# EAGLE design Teseo (EAGLE 9.0.0)
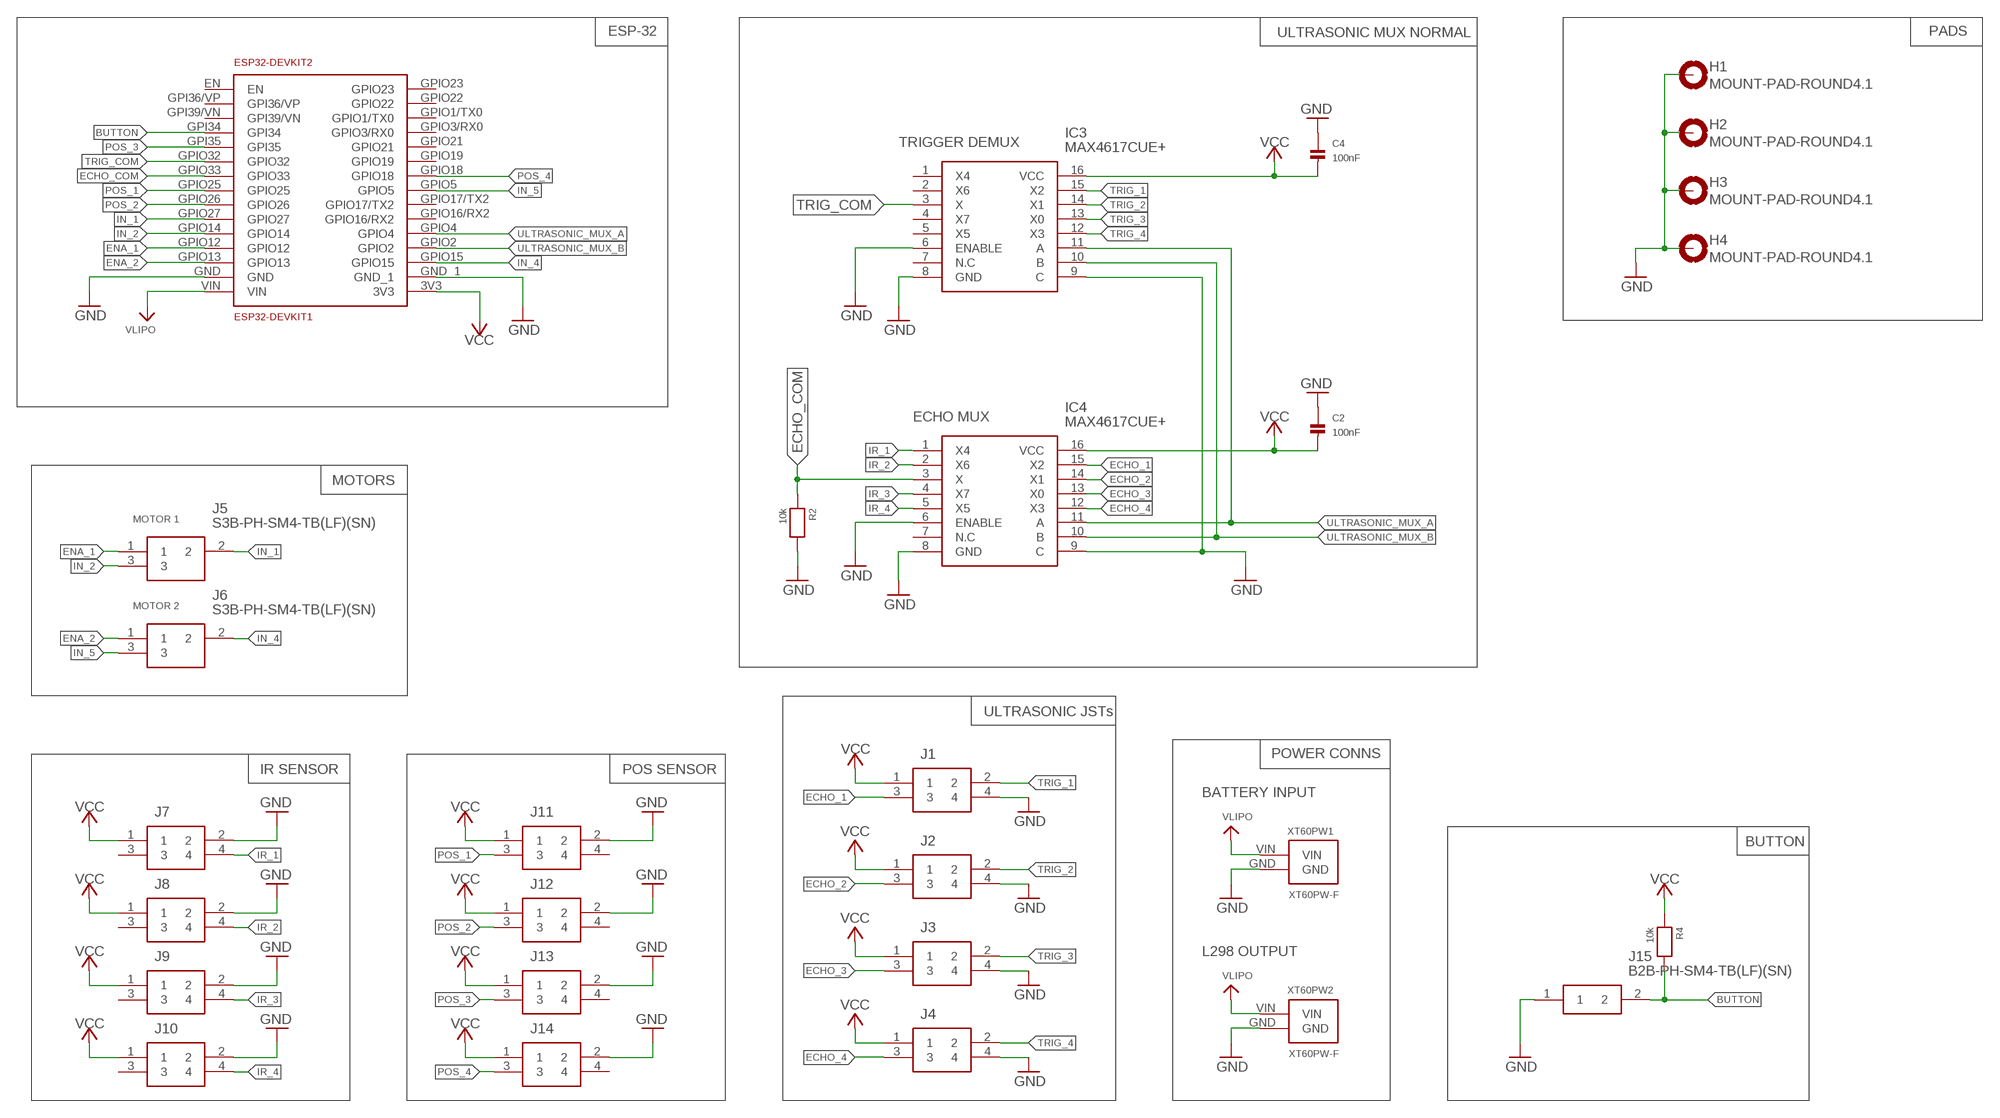
[diagram p0: schematic, sheet 1]

## Parts
C2  100nF  CAP_CERAMIC0805  [0805]
C4  100nF  CAP_CERAMIC0805  [0805]
ESP32-DEVKIT2  ESP32-DEVKIT1  [ESP32-DEVKIT1]
H1  MOUNT-PAD-ROUND4.1  [4,1-PAD]
H2  MOUNT-PAD-ROUND4.1  [4,1-PAD]
H3  MOUNT-PAD-ROUND4.1  [4,1-PAD]
H4  MOUNT-PAD-ROUND4.1  [4,1-PAD]
IC3  MAX4617CUE+  [SOP65P640X110-16N]
IC4  MAX4617CUE+  [SOP65P640X110-16N]
J1  S4B-PH-SM4-TB(LF)(SN)  [S4B-PH-SM4-TB]
J2  S4B-PH-SM4-TB(LF)(SN)  [S4B-PH-SM4-TB]
J3  S4B-PH-SM4-TB(LF)(SN)  [S4B-PH-SM4-TB]
J4  S4B-PH-SM4-TB(LF)(SN)  [S4B-PH-SM4-TB]
J5  S3B-PH-SM4-TB(LF)(SN)  [S3B-PH-SM4-TB]
J6  S3B-PH-SM4-TB(LF)(SN)  [S3B-PH-SM4-TB]
J7  S4B-PH-SM4-TB(LF)(SN)  [S4B-PH-SM4-TB]
J8  S4B-PH-SM4-TB(LF)(SN)  [S4B-PH-SM4-TB]
J9  S4B-PH-SM4-TB(LF)(SN)  [S4B-PH-SM4-TB]
J10  S4B-PH-SM4-TB(LF)(SN)  [S4B-PH-SM4-TB]
J11  S4B-PH-SM4-TB(LF)(SN)  [S4B-PH-SM4-TB]
J12  S4B-PH-SM4-TB(LF)(SN)  [S4B-PH-SM4-TB]
J13  S4B-PH-SM4-TB(LF)(SN)  [S4B-PH-SM4-TB]
J14  S4B-PH-SM4-TB(LF)(SN)  [S4B-PH-SM4-TB]
J15  B2B-PH-SM4-TB(LF)(SN)  [B2B-PH-SM4-TB]
R2  10k  RESISTOR_0805  [_0805]
R4  10k  RESISTOR_0805  [_0805]
XT60PW1  XT60PW-F  [XT60PW-F]
XT60PW2  XT60PW-F  [XT60PW-F]

## Nets
BUTTON: ESP32-DEVKIT2.GPI34 J15.2 R4.2
ECHO_1: IC4.15(X2) J1.3
ECHO_2: IC4.14(X1) J2.3
ECHO_3: IC4.13(X0) J3.3
ECHO_4: IC4.12(X3) J4.3
ECHO_COM: ESP32-DEVKIT2.GPIO33 IC4.3(X) R2.1
ENA_1: ESP32-DEVKIT2.GPIO12 J5.1
ENA_2: ESP32-DEVKIT2.GPIO13 J6.1
GND: C2.1 C4.1 ESP32-DEVKIT2.GND ESP32-DEVKIT2.GND_1 H1.B4,1(MOUNT) H2.B4,1(MOUNT) H3.B4,1(MOUNT) H4.B4,1(MOUNT) IC3.6(ENABLE) IC3.8(GND) IC3.9(C) IC4.6(ENABLE) IC4.8(GND) IC4.9(C) J1.4 J2.4 J3.4 J4.4 J7.2 J8.2 J9.2 J10.2 J11.2 J12.2 J13.2 J14.2 J15.1 R2.2 XT60PW1.GND XT60PW2.GND
IN_1: ESP32-DEVKIT2.GPIO27 J5.2
IN_2: ESP32-DEVKIT2.GPIO14 J5.3
IN_4: ESP32-DEVKIT2.GPIO15 J6.2
IN_5: ESP32-DEVKIT2.GPIO5 J6.3
IR_1: IC4.1(X4) J7.4
IR_2: IC4.2(X6) J8.4
IR_3: IC4.4(X7) J9.4
IR_4: IC4.5(X5) J10.4
POS_1: ESP32-DEVKIT2.GPIO25 J11.3
POS_2: ESP32-DEVKIT2.GPIO26 J12.3
POS_3: ESP32-DEVKIT2.GPI35 J13.3
POS_4: ESP32-DEVKIT2.GPIO18 J14.3
TRIG_1: IC3.15(X2) J1.2
TRIG_2: IC3.14(X1) J2.2
TRIG_3: IC3.13(X0) J3.2
TRIG_4: IC3.12(X3) J4.2
TRIG_COM: ESP32-DEVKIT2.GPIO32 IC3.3(X)
ULTRASONIC_MUX_A: ESP32-DEVKIT2.GPIO4 IC3.11(A) IC4.11(A)
ULTRASONIC_MUX_B: ESP32-DEVKIT2.GPIO2 IC3.10(B) IC4.10(B)
VCC: C2.2 C4.2 ESP32-DEVKIT2.3V3 IC3.16(VCC) IC4.16(VCC) J1.1 J2.1 J3.1 J4.1 J7.1 J8.1 J9.1 J10.1 J11.1 J12.1 J13.1 J14.1 R4.1
VLIPO: ESP32-DEVKIT2.VIN XT60PW1.VIN XT60PW2.VIN
Unconnected: ESP32-DEVKIT2.EN ESP32-DEVKIT2.GPI36/VP ESP32-DEVKIT2.GPI39/VN ESP32-DEVKIT2.GPIO1/TX0 ESP32-DEVKIT2.GPIO3/RX0 ESP32-DEVKIT2.GPIO16/RX2 ESP32-DEVKIT2.GPIO17/TX2 ESP32-DEVKIT2.GPIO19 ESP32-DEVKIT2.GPIO21 ESP32-DEVKIT2.GPIO22 ESP32-DEVKIT2.GPIO23 IC3.1(X4) IC3.2(X6) IC3.4(X7) IC3.5(X5) IC3.7(N.C) IC4.7(N.C) J7.3 J8.3 J9.3 J10.3 J11.4 J12.4 J13.4 J14.4

## Notes on the sheet
- ESP-32 | ULTRASONIC MUX NORMAL | PADS
- TRIGGER DEMUX
- ECHO MUX
- MOTORS
- MOTOR 1
- MOTOR 2
- ULTRASONIC JSTs
- POWER CONNS
- IR SENSOR | POS SENSOR
- BATTERY INPUT
- BUTTON
- L298 OUTPUT

## Library data of the parts
C2 C4 = microbuilder:CAP_CERAMIC: Ceramic Capacitors 0402 - 0402 Surface Mount Capacitors 16pF 50V 5% [Digikey: 445-4899-2-ND] 18pF 50V 5% [Digikey: 490-1281-2-ND] 22pF 50V 5% [Digikey: 490-1283-2-ND] 68pF 50V 5% [Digikey: 490-1289-2-ND] 0.1uF 10V 10% [Digikey: 490-1318-2-ND] 1.0uF 6.3V 10% [Digikey: 490-1320-2-ND] 0603 - 0603 Surface Mount Capacitors 16 pF 50V 5% [Digikey: 445-5051-2-ND] 22 pF 50V [Digikey: PCC220ACVTR-ND] 33 pF 50V 5% [Digikey: 490-1415-1-ND] 56pF 50V 5% [Digikey: 490-1421-1-ND] 220pF 50V 5% [Digikey: 445-1285-1-ND] 680 pF 50V 2200 pF 50V 5% C0G [Digikey: 445-1297-1-ND] 5600 pF 100V 5% X7R [Digikey: 478-3711-1-ND] 0.1 µF 25V 10% [Digikey: PCC2277TR-ND] 0.22 µF 16V 10% X7R [Digikey: 445-1318-1-ND] 1.0 µF 25V 10% [Digikey: 445-5146-2-ND] 0603 - RF Specific 3pF 250V +/-0.1pF RF [Digikey: 712-1347-1-ND] 18 pF 250V 5% [Digikey: 478-3505-1-ND or 712-1322-1-ND] 56 pF 250V 5% C0G RF [Digikey: 490-4867-1-ND] 68 pF 250V RF [Digikey: 490-4868-1-ND] 0805 - 0805 Surface Mount Capacitors 220 pF 250V 2% RF Ceramic Capacitor [Digikey: 712-1398-1-ND] 1000 pF 50V 2% NP0 Ceramic Capacitor [Digikey: 478-3760-1-ND] 0.1 µF 25V 10% Ceramic Capacitor [Digikey: PCC1828TR-ND] 1.0 µF 16V 10% Ceramic Capacitor[Digikey: 490-1691-2-ND] 10.0 µF 10V 10% Ceramic Capacitor[Digikey: 709-1228-1-ND] 10.0 uF 16V 10% Ceramic Capacitor [Digikey: 478-5165-2-ND] 47 uF 6.3V 20% Ceramic Capacitor [Digikey: 587-1779-1-ND or 399-5506-1-ND] 1206 - 1206 Surface Mount Capacitors 47uF 10V 20% Ceramic Capacitor [Digikey: 490-5528-1-ND or 399-5508-1-ND or 445-6010-1-ND] 100uF 6.3V -20%, +80% Y5V Ceramic Capacitor (Digikey: 490-4512-1-ND, Mouser: 81-GRM31CF50J107ZE1L)
ESP32-DEVKIT2 = mylibrary:ESP32-DEVKIT1
H1-H4 = holes:MOUNT-PAD-ROUND: MOUNTING PAD, round
IC3 IC4 = SamacSys_Parts:MAX4617CUE+: MAXIM INTEGRATED PRODUCTS - MAX4617CUE+ - MULTIPLEXER, 8X1, 10OHM RON, 16TSSOP Source: Datasheet <https://datasheets.maximintegrated.com/en/ds/MAX4617-MAX4619.pdf>; DESCRIPTION: MAXIM INTEGRATED PRODUCTS - MAX4617CUE+ - MULTIPLEXER, 8X1, 10OHM RON, 16TSSOP; HEIGHT: 1.1mm; MANUFACTURER_NAME: Maxim Integrated; MANUFACTURER_PART_NUMBER: MAX4617CUE+; MOUSER_PART_NUMBER: 700-MAX4617CUE; MOUSER_PRICE-STOCK: https://www.mouser.com/Search/Refine.aspx?Keyword=700-MAX4617CUE
J1-J4 J7-J14 = SamacSys_Parts:S4B-PH-SM4-TB(LF)(SN): PH SMT side entry shroud header 4 way JST PH Series, 2mm Pitch 4 Way 1 Row Right Angle PCB Header, Solder Termination, 2A Source: Datasheet <http://uk.rs-online.com/web/p/products/6881366>; ARROW_PART_NUMBER: S4B-PH-SM4-TB(LF)(SN); ARROW_PRICE/STOCK: https://www.arrow.com/en/products/s4b-ph-sm4-tb-lf-sn/jst-manufacturing; DESCRIPTION: PH SMT side entry shroud header 4 way JST PH Series, 2mm Pitch 4 Way 1 Row Right Angle PCB Header, Solder Termination, 2A; HEIGHT: mm; MANUFACTURER_NAME: JST (JAPAN SOLDERLESS TERMINALS); MANUFACTURER_PART_NUMBER: S4B-PH-SM4-TB(LF)(SN); RS_PART_NUMBER: 6881366P; RS_PRICE/STOCK: http://uk.rs-online.com/web/p/products/6881366P
J5 J6 = SamacSys_Parts:S3B-PH-SM4-TB(LF)(SN): PH SMT side entry shroud header 3 way JST PH Series, 2mm Pitch 3 Way 1 Row Right Angle PCB Header, Solder Termination, 2A Source: Datasheet <http://docs-emea.rs-online.com/webdocs/13ce/0900766b813ce4c2.pdf>; DESCRIPTION: PH SMT side entry shroud header 3 way JST PH Series, 2mm Pitch 3 Way 1 Row Right Angle PCB Header, Solder Termination, 2A; HEIGHT: mm; MANUFACTURER_NAME: JST (JAPAN SOLDERLESS TERMINALS); MANUFACTURER_PART_NUMBER: S3B-PH-SM4-TB(LF)(SN); RS_PART_NUMBER: 6881357P; RS_PRICE-STOCK: http://uk.rs-online.com/web/p/products/6881357P
J15 = SamacSys_Parts:B2B-PH-SM4-TB(LF)(SN): Wire-To-Board Connector, PH Series, 2 Contacts, Header, 2 mm, Surface Mount, 1 Rows Source: Datasheet <http://www.jst-mfg.com/product/pdf/eng/ePH.pdf>; DESCRIPTION: Wire-To-Board Connector, PH Series, 2 Contacts, Header, 2 mm, Surface Mount, 1 Rows; HEIGHT: mm; MANUFACTURER_NAME: JST (JAPAN SOLDERLESS TERMINALS); MANUFACTURER_PART_NUMBER: B2B-PH-SM4-TB(LF)(SN); RS_PART_NUMBER: 6881325P; RS_PRICE-STOCK: http://uk.rs-online.com/web/p/products/6881325P
R2 R4 = microbuilder:RESISTOR: Resistors 0402 - 0402 Surface Mount Package 22 Ohm 1% 1/16W [Digikey: 311-22.0LRTR-ND] 33 Ohm 5% 1/16W 1.0K 5% 1/16W 1.5K 5% 1/16W 2.0K 1% 1/16W 10.0K 1% 1/16W [Digikey: 311-10.0KLRTR-ND] 10.0K 5% 1/16W [Digikey: RMCF0402JT10K0TR-ND] 12.1K 1% 1/16W [Digikey: 311-22.0LRTR-ND] 100.0K 5% 1/16W 0603 - 0603 Surface Mount Package 0 Ohm 1/10 Watt 1% Resistor 15 Ohm 1/10 Watt 1% Resistor 33 Ohm 1/10 Watt 1% Resistor 49.9 Ohm 1/10 Watt 1% Resistor 100 Ohm 1/10 Watt 1% Resistor 150 Ohm 1/10 Watt 1% Resistor 240 Ohm 1/10 Watt 1% Resistor 390 Ohm 1/10 Watt 1% Resistor 560 Ohm 1/10 Watt 1% Resistor 680 Ohm 1/10 Watt 1% Resistor 750 Ohm 1/10 Watt 1% Resistor 1.0K Ohm 1/10 Watt 1% Resistor 1.5K Ohm 1/10 Watt 1% Resistor 2.0K Ohm 1/10 Watt 1% Resistor 2.2K Ohm 1/10 Watt 1% Resistor 3.3K Ohm 1/10 Watt 1% Resistor 4.7K Ohm 1/10 Watt 1% Resistor 10.0K Ohm 1/10 Watt 1% Resistor 12.0K Ohm 1/10 Watt 1% Resistor 12.1K Ohm 1/10 Watt 1% Resistor 20.0K Ohm 1/10 Watt 1% Resistor 33.0K Ohm 1/10 Watt 1% Resistor 100.0K Ohm 1/10 Watt 1% Resistor 0805 - 0805 Surface Mount Package 0 Ohm 1/8 Watt 1% Resistor 33 Ohm 1/8 Watt 1% Resistor 100 Ohm 1/8 Watt 1% Resistor 150 Ohm 1/8 Watt 1% Resistor 200 Ohm 1/8 Watt 1% Resistor 240 Ohm 1/8 Watt 1% Resistor 330 Ohm 1/8 Watt 1% Resistor 390 Ohm 1/8 Watt 1% Resistor 470 Ohm 1/8 Watt 1% Resistor 1.0K Ohm 1/8 Watt 1% Resistor 1.5K Ohm 1/8 Watt 1% Resistor 2.0K Ohm 1/8 Watt 1% Resistor 4.7K Ohm 1/8 Watt 1% Resistor 5.1K Ohm 1/8 Watt 1% Resistor 5.6K Ohm 1/8 Watt 1% Resistor 10.0K Ohm 1/8 Watt 1% Resistor 22.0K Ohm 1/8 Watt 1% Resistor 33.0K Ohm 1/8 Watt 1% Resistor 100K Ohm 1/8 Watt 1% Resistor 1206 - 1206 Surface Mount Package 2012 - 2010 Surface Mount Package 0.11 Ohm 1/2 Watt 1% Resistor - Digikey: RHM.11UCT-ND
XT60PW1 XT60PW2 = mylibrary:XT60PW-F; SPICEPREFIX: X

## Board
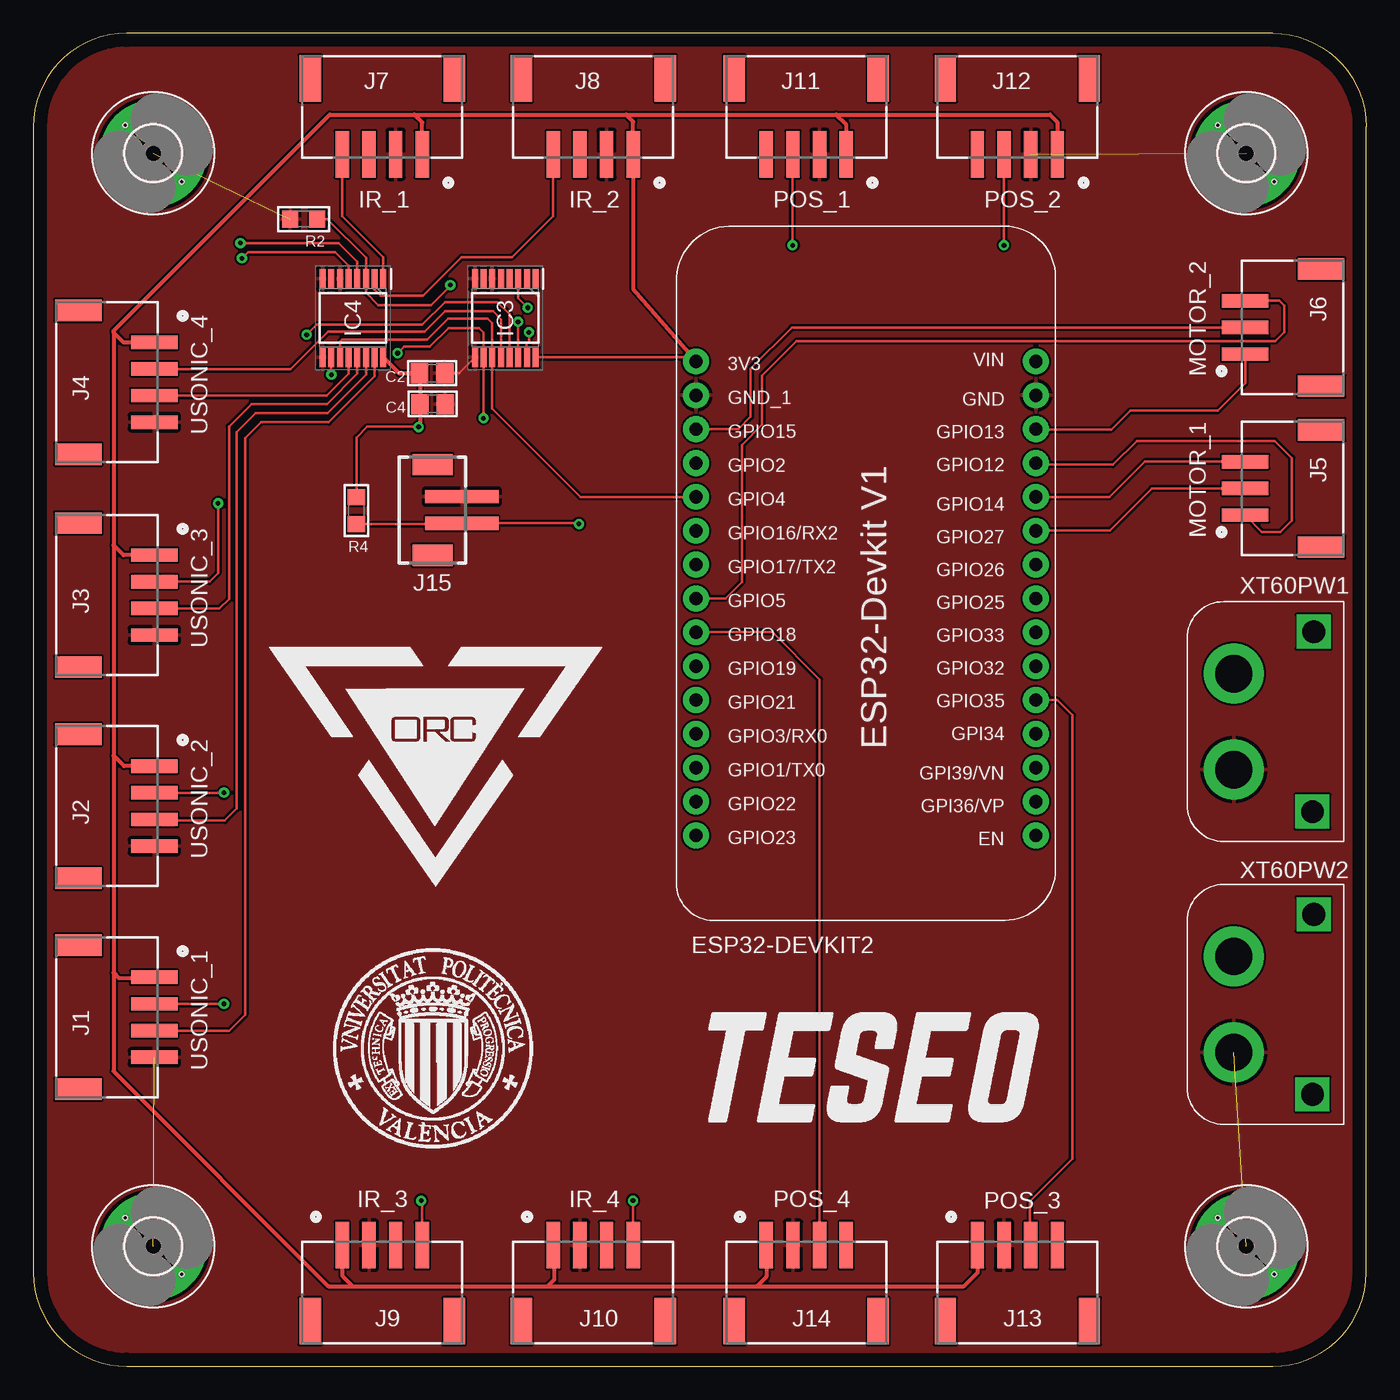
[diagram p1: board, top side]
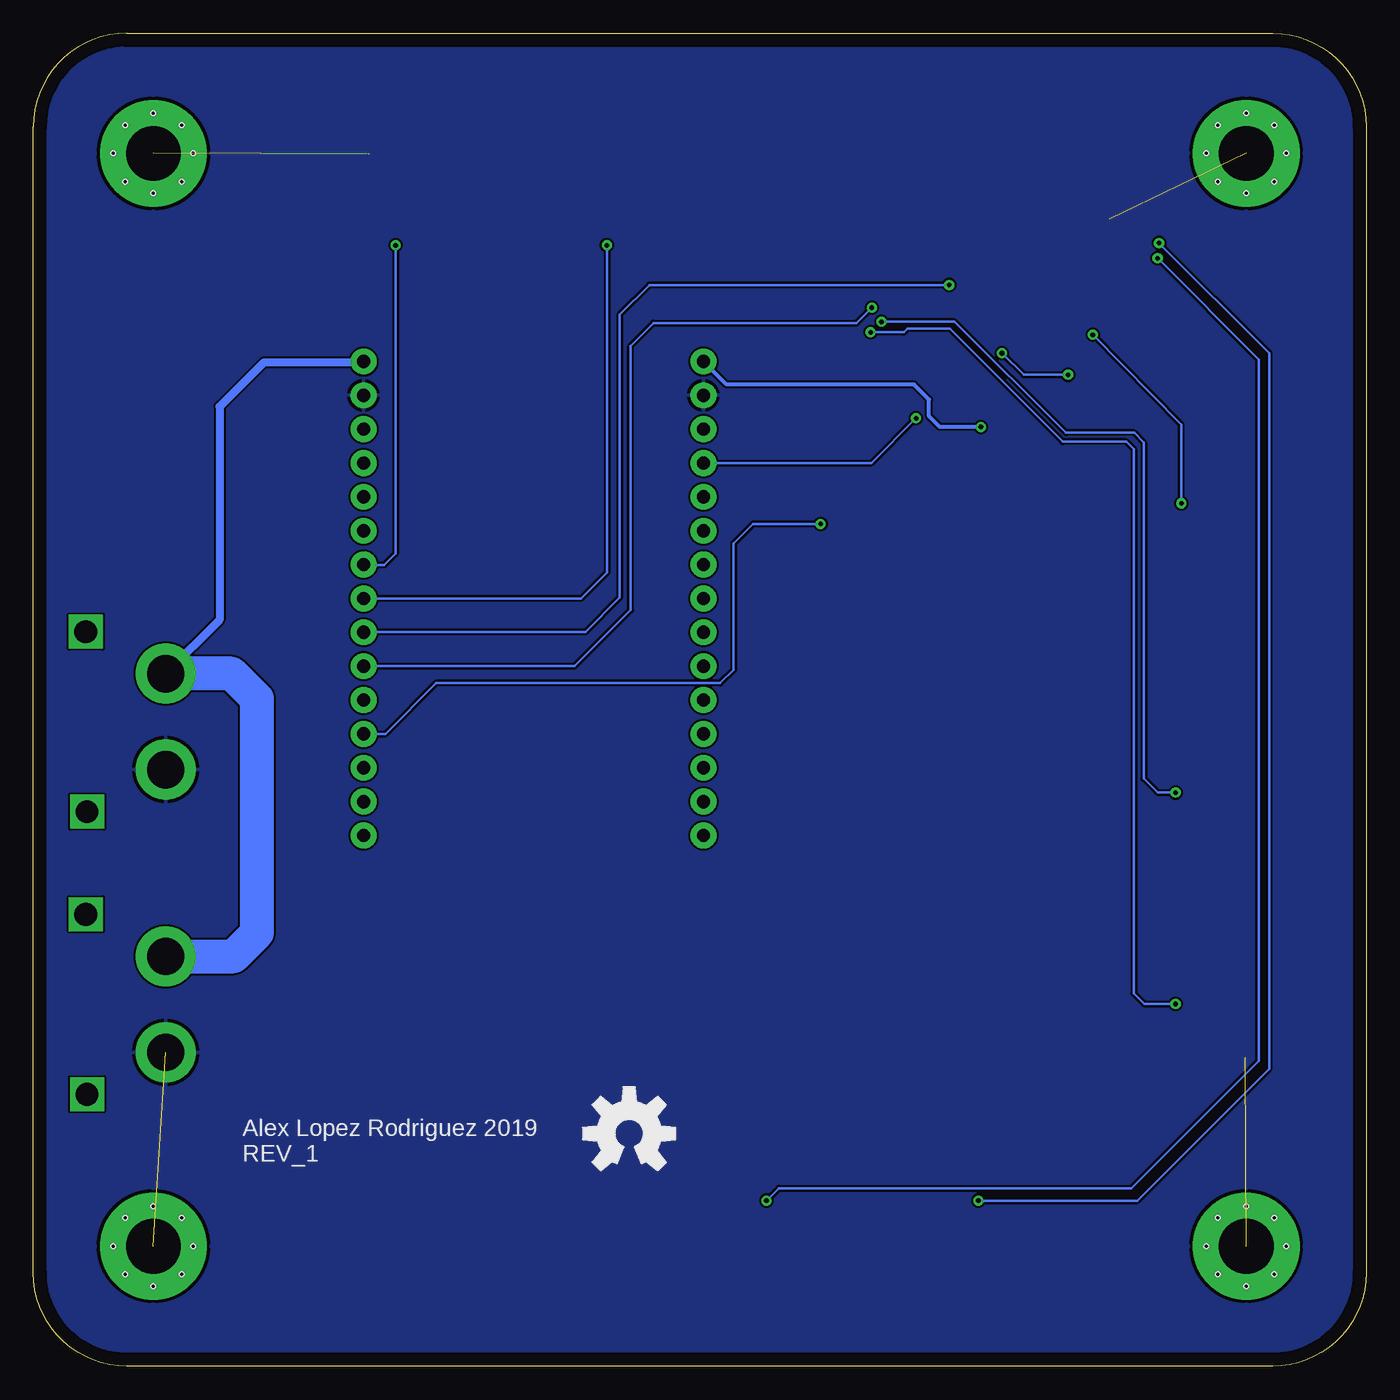
[diagram p2: board, bottom side, seen from below]

Size 100 x 100 mm. Coordinates in mm from the lower left corner, seen from the top.
Outline: 7,0 93,0 arc90 100,7 100,93 arc90 93,100 7,100 arc90 0,93 0,7 arc90 7,0
Copper layers (1*16): Top 0.035mm / dielectric 1.5mm / Bottom 0.035mm
Design rules "default": minimum track width 6mil, minimum drill 0.35mm, track to track 6mil, track to pad 6mil, pad to pad 6mil, via to via 6mil, smd to smd 6mil, copper to edge 40mil, drill to drill 6mil, minimum pad ring 10mil, minimum via ring 8mil, stop-mask expansion 4mil, vias tented up to drill 0mil, thermal gap 10mil
Holes 0.35 mm at 9,94 9,88 12,91 6,91 9,12 9,6 12,9 6,9 91,12 94,9 91,6 88,9 91,94 94,91 88,91 91,88 93.12,93.12 93.12,88.88 88.88,88.88 88.88,93.12 6.88,93.12 11.12,93.12 11.12,88.88 6.88,88.88 11.12,11.12 6.88,11.12 6.88,6.88 11.12,6.88 88.88,6.88 93.12,6.88 93.12,11.12 88.88,11.12

### Footprints (pad centres in the part's own frame; a part is rotated, then mirrored left to right if it is on the bottom)
0805 = smd 1.3 x 1.5: 1 -0.95,0; 2 0.95,0
ESP32-DEVKIT1 = drill 1 pad 1.93: 3V3 27.72,9.99; EN 2.22,45.55; GND 2.22,12.53; GND_1 27.72,12.53; GPI34 2.22,37.93; GPI35 2.22,35.39; GPI36/VP 2.22,43.01; GPI39/VN 2.22,40.47; GPIO1/TX0 27.72,40.47; GPIO2 27.72,17.61; GPIO3/RX0 27.72,37.93; GPIO4 27.72,20.15; GPIO5 27.72,27.77; GPIO12 2.22,17.61; GPIO13 2.22,15.07; GPIO14 2.22,20.15; GPIO15 27.72,15.07; GPIO16/RX2 27.72,22.69; GPIO17/TX2 27.72,25.23; GPIO18 27.72,30.31; GPIO19 27.72,32.85; GPIO21 27.72,35.39; GPIO22 27.72,43.01; GPIO23 27.72,45.55; GPIO25 2.22,27.77; GPIO26 2.22,25.23; GPIO27 2.22,22.69; GPIO32 2.22,32.85; GPIO33 2.22,30.31; VIN 2.22,9.99
4,1-PAD = drill 4.1 pad 8: B4,1 0,0
SOP65P640X110-16N = smd 1.475 x 0.45: 1 -2.938,2.275; 2 -2.938,1.625; 3 -2.938,0.975; 4 -2.938,0.325; 5 -2.938,-0.325; 6 -2.938,-0.975; 7 -2.938,-1.625; 8 -2.938,-2.275; 9 2.938,-2.275; 10 2.938,-1.625; 11 2.938,-0.975; 12 2.938,-0.325; 13 2.938,0.325; 14 2.938,0.975; 15 2.938,1.625; 16 2.938,2.275
S4B-PH-SM4-TB = smd 1 x 3.5: 1 6,0; 2 4,0; 3 2,0; 4 0,0 | smd 1.6 x 3.5: 5 -2.4,5.7; 6 8.4,5.7
S3B-PH-SM4-TB = smd 1 x 3.5: 1 2,0; 2 0,0; 3 -2,0 | smd 1.6 x 3.5: 4 -4.4,5.7; 5 4.4,5.7
B2B-PH-SM4-TB = smd 1 x 5.5: 1 -1,0; 2 1,0 | smd 1.6 x 3: 3 -3.4,-2.2; 4 3.4,-2.2
_0805 = smd 1.2 x 1.3: 1 -1.016,0; 2 1.016,0
XT60PW-F = drill 2.8 pad 4.5: GND 12.6,3.5; VIN 5.4,3.5 | drill 1.7 pad 2.5 square: P$1 2.25,9.5; P$2 15.75,9.4

### Placement (x,y rotation side)
C2  29.92,74.5 180 top
C4  29.95,72.2 180 top
ESP32-DEVKIT2  77.44,85.37 180 top
H1  9,91 0 top
H2  91,91 0 top
H3  91,9 0 top
H4  9,9 0 top
IC3  35.41,78.64 270 top
IC4  23.98,78.64 270 top
J1  9.08,23.18 90 top
J2  9.08,39.01 90 top
J3  9.08,54.85 90 top
J4  9.08,70.82 90 top
J5  90.92,65.86 270 top
J6  90.92,77.93 270 top
J7  23.18,90.92 0 top
J8  39.01,90.92 0 top
J9  29.18,9.08 180 top
J10  45.01,9.08 180 top
J11  54.99,90.92 0 top
J12  70.83,90.92 0 top
J13  76.83,9.08 180 top
J14  60.99,9.08 180 top
J15  32.15,64.24 270 top
R2  20.28,86.06 180 top
R4  24.24,64.19 270 top
U$1  [OSHW-LOGO-L]  55.3,17.46 0 bottom
XT60PW1  86.57,57.36 270 top
XT60PW2  86.57,36.15 270 top

### Tracks (layer width: path | path; a pad name or v marks a point on that pad's centre or on a via)
BUTTON  (via drill 0.35)
  Top 0.203: R4.2 32.34,63.19 J15.2 40.85,63.24 40.93,63.16 v40.93,63.19
  Bottom 0.203: v40.93,63.19 45.99,63.19 47.46,61.72 47.46,52.25 48.47,51.24 69.78,51.24 73.58,47.44 ESP32-DEVKIT2.GPI34
ECHO_1
  Top 0.203: IC4.15 25.61,74.27 22.17,70.83 17.08,70.83 15.88,69.63 15.88,26.36 14.68,25.16 9.1,25.16 J1.3
ECHO_2
  Top 0.203: IC4.14 24.95,74.39 22.07,71.51 16.69,71.51 15.26,70.08 15.26,41.84 14.36,40.94 9.15,40.94 J2.3
ECHO_3
  Top 0.203: IC4.13 24.3,74.47 22.03,72.2 16.37,72.2 14.68,70.51 14.68,57.57 13.96,56.85 J3.3
ECHO_4
  Top 0.203: J4.3 22.02,72.82 23.66,74.45 IC4.12
ECHO_COM  (via drill 0.35)
  Top 0.203: R2.1 22.06,86.06 24.95,83.17 IC4.3 24.95,80.53 25.86,79.62 29.83,79.62 31.26,81.05 31.26,81.1 v31.28,81.12 v31.29,81.12
  Bottom 0.203: v31.29,81.12 53.77,81.12 56.01,78.88 56.01,57.67 58.58,55.1 75.18,55.1 ESP32-DEVKIT2.GPIO33
ENA_1
  Top 0.203: J5.1 92.18,62.6 93.57,62.6 94.43,63.46 94.43,68.14 93.15,69.42 82.78,69.42 80.99,67.63 75.35,67.63 ESP32-DEVKIT2.GPIO12
ENA_2
  Top 0.203: ESP32-DEVKIT2.GPIO13 75.25,70.27 80.87,70.27 82.29,71.69 88.86,71.69 90.92,73.75 J6.1
GND  (4 unrouted)
  Top 0.203: C2.1 31.93,74.5 IC3.9
  pour Top: 0,100 100,100 100,0 0,0
  pour Bottom: -0.08,101.53 100.89,101.74 100.93,-0.97 -0.89,-0.89 -0.97,101.48 -0.97,101.53
IN_1
  Top 0.203: J5.2 83.91,65.86 80.76,62.71 75.25,62.71 ESP32-DEVKIT2.GPIO27
IN_2
  Top 0.203: J5.3 83.39,67.86 80.74,65.21 ESP32-DEVKIT2.GPIO14
IN_4
  Top 0.203: J6.2 56.91,77.93 53.81,74.83 53.81,71.23 52.89,70.31 50.46,70.31 ESP32-DEVKIT2.GPIO15
IN_5
  Top 0.203: J6.3 93.49,79.93 93.85,79.57 93.85,77.57 93.19,76.91 57.26,76.91 54.67,74.32 54.67,70.64 53.15,69.12 53.15,58.82 51.93,57.6 ESP32-DEVKIT2.GPIO5
IR_1
  Top 0.203: J7.4 23.18,86.28 26.26,83.2 IC4.1
IR_2
  Top 0.203: IC4.2 25.61,80.77 26.06,80.31 29.25,80.31 32.14,83.2 32.14,83.21 35.94,83.21 39.01,86.28 J8.4
IR_3  (via drill 0.35)
  Top 0.203: IC4.4 24.3,82.86 22.92,84.25 15.56,84.25 v15.54,84.27 | J9.4 29.18,12.44 29.16,12.45 29.13,12.42 v29.1,12.42
  Bottom 0.203: v29.1,12.42 17.18,12.42 7.28,22.32 7.28,76.01 v15.54,84.27
IR_4  (via drill 0.35)
  Top 0.203: IC4.5 23.66,82.56 22.65,83.57 16.1,83.57 v15.65,83.12 | J10.4 45.01,12.55 44.99,12.57 v44.99,12.42
  Bottom 0.203: v44.99,12.42 44.06,13.35 17.62,13.35 8.06,22.91 8.06,75.53 v15.65,83.12
POS_1  (via drill 0.35)
  Top 0.203: v56.97,84.1 56.97,90.9 J11.3
  Bottom 0.203: ESP32-DEVKIT2.GPIO25 58.91,57.6 56.97,59.54 v56.97,84.1
POS_2  (via drill 0.35)
  Top 0.203: J12.3 72.83,88.42 v72.82,84.1
  Bottom 0.203: v72.82,84.1 72.82,60.97 73.68,60.11 75.19,60.11 ESP32-DEVKIT2.GPIO26
POS_3
  Top 0.203: ESP32-DEVKIT2.GPI35 76.84,49.98 77.97,48.85 77.97,15.55 74.78,12.36 74.78,9.12 J13.3
POS_4
  Top 0.203: J14.3 58.99,51.53 55.44,55.08 50.47,55.08 ESP32-DEVKIT2.GPIO18
TRIG_1  (via drill 0.35)
  Top 0.203: 9.4,27.5 J1.2 13.59,27.18 v14.3,27.18 | v37.18,77.57 37.18,76.87 37,76.69 37,75.74 IC3.15
  Bottom 0.203: v37.18,77.57 v37.18,77.56 37.17,77.55 37.14,77.58 34.69,77.58 34.43,77.84 31.24,77.84 22.76,69.36 18.01,69.36 17.44,68.79 17.44,27.98 16.64,27.18 v14.3,27.18
TRIG_2  (via drill 0.35)
  Top 0.203: v36.37,78.36 36.37,75.72 IC3.14 | J2.2 14.28,43.01 v14.3,43.03
  Bottom 0.203: v36.37,78.36 30.9,78.36 22.53,70.03 17.41,70.03 16.69,69.31 16.69,44.09 15.63,43.03 v14.3,43.03
TRIG_3  (via drill 0.35)
  Top 0.203: 35.71,75.73 IC3.13 35.73,78.92 34.81,79.84 30.88,79.84 29.17,78.13 21.25,78.13 v20.5,77.39 | v13.86,64.74 13.86,59.49 13.22,58.85 J3.2
  Bottom 0.203: v20.5,77.39 13.87,70.65 v13.87,64.75 v13.86,64.74
TRIG_4
  Top 0.203: IC3.12 35.11,75.73 35.11,78.51 34.48,79.14 30.9,79.14 29.37,77.61 22.11,77.61 19.32,74.82 J4.2
TRIG_COM  (via drill 0.35)
  Top 0.203: v37.09,79.42 36.38,80.12 IC3.3
  Bottom 0.203: ESP32-DEVKIT2.GPIO32 59.4,52.52 55.19,56.73 55.19,76.55 53.47,78.27 38.24,78.27 v37.09,79.42
ULTRASONIC_MUX_A
  Top 0.203: ESP32-DEVKIT2.GPIO4 41.04,65.22 34.4,71.86 34.4,75.67 IC3.11 34.41,75.73 34.41,78.26 34.07,78.6 31.1,78.6 29.53,77.03 23.18,77.03 23,76.86 IC4.11
ULTRASONIC_MUX_B  (via drill 0.35)
  Top 0.203: v33.77,71.12 33.77,75.59 | 33.77,75.59 33.77,75.69 IC3.10 | IC4.10 v22.36,74.39 v22.36,74.38 | v27.32,76.01 v27.33,76.01 27.8,76.48 29.75,76.48 31.14,77.88 33.43,77.88 33.77,77.54 33.77,75.59
  Bottom 0.203: ESP32-DEVKIT2.GPIO2 37.13,67.76 v33.77,71.12 | v27.33,76.01 25.7,74.38 v22.36,74.38
VCC  (via drill 0.35)
  Top 0.203: R4.1 24.24,69.68 25.05,70.49 28.93,70.49 29,70.56 | IC3.16 49.41,75.7 49.66,75.44
  Top 0.305: 6.02,77.55 6.02,77.69 22.24,93.91 28.58,93.91 | 6.02,77.55 6.02,61.6 | 6.02,61.6 6.02,45.81 | 6.02,45.81 6.02,29.53 | 6.02,29.53 6.42,29.13 9.03,29.13 J1.1 | J2.1 6.82,45.01 6.02,45.81 | J3.1 6.77,60.85 6.02,61.6 | J12.1 76.83,93.35 76.27,93.91 60.23,93.91 | 28.58,93.91 44.47,93.91 | 44.47,93.91 60.23,93.91 | J11.1 60.99,93.15 60.23,93.91 | 44.47,93.91 45.01,93.37 J8.1 45.01,80.82 49.66,75.44 ESP32-DEVKIT2.3V3 | J7.1 29.18,93.31 28.58,93.91 | J9.1 23.18,6.79 23.95,6.01 | 23.95,6.01 38.59,6.01 | 38.59,6.01 39.09,6.51 39.09,9 J10.1 | 6.02,29.53 6.02,22.12 22.13,6.01 23.95,6.01 | IC4.16 27.46,74.5 C2.2 29,74.47 C4.2 29,70.56 v28.91,70.47 | 6.02,77.55 6.75,76.82 J4.1 | J13.1 70.85,9.05 70.85,7.04 69.82,6.01 54.28,6.01 | 38.59,6.01 54.28,6.01 | J14.1 54.99,6.72 54.28,6.01
  Bottom 0.305: v28.91,70.47 31.98,70.47 32.8,71.28 32.8,72.53 33.92,73.65 47.99,73.65 ESP32-DEVKIT2.3V3
VLIPO
  Bottom 0.61: ESP32-DEVKIT2.VIN 75.27,75.33 82.7,75.33 86.03,72 86.03,56 XT60PW1.VIN
  Bottom 2.54: XT60PW1.VIN 85.12,51.96 83.22,50.06 83.22,32.51 84.98,30.75 XT60PW2.VIN

### Text on the board
tPlace: MOTOR_2 | USONIC_4 | MOTOR_1 | USONIC_3 | USONIC_2 | USONIC_1
bPlace: Alex Lopez Rodriguez 2019 / REV_1
tNames: IR_1 | IR_2 | POS_1 | POS_2 | IR_3 | IR_4 | POS_4 | POS_3